# Altium schematic sheet ArduinoNanoShield.SchDoc
size A4
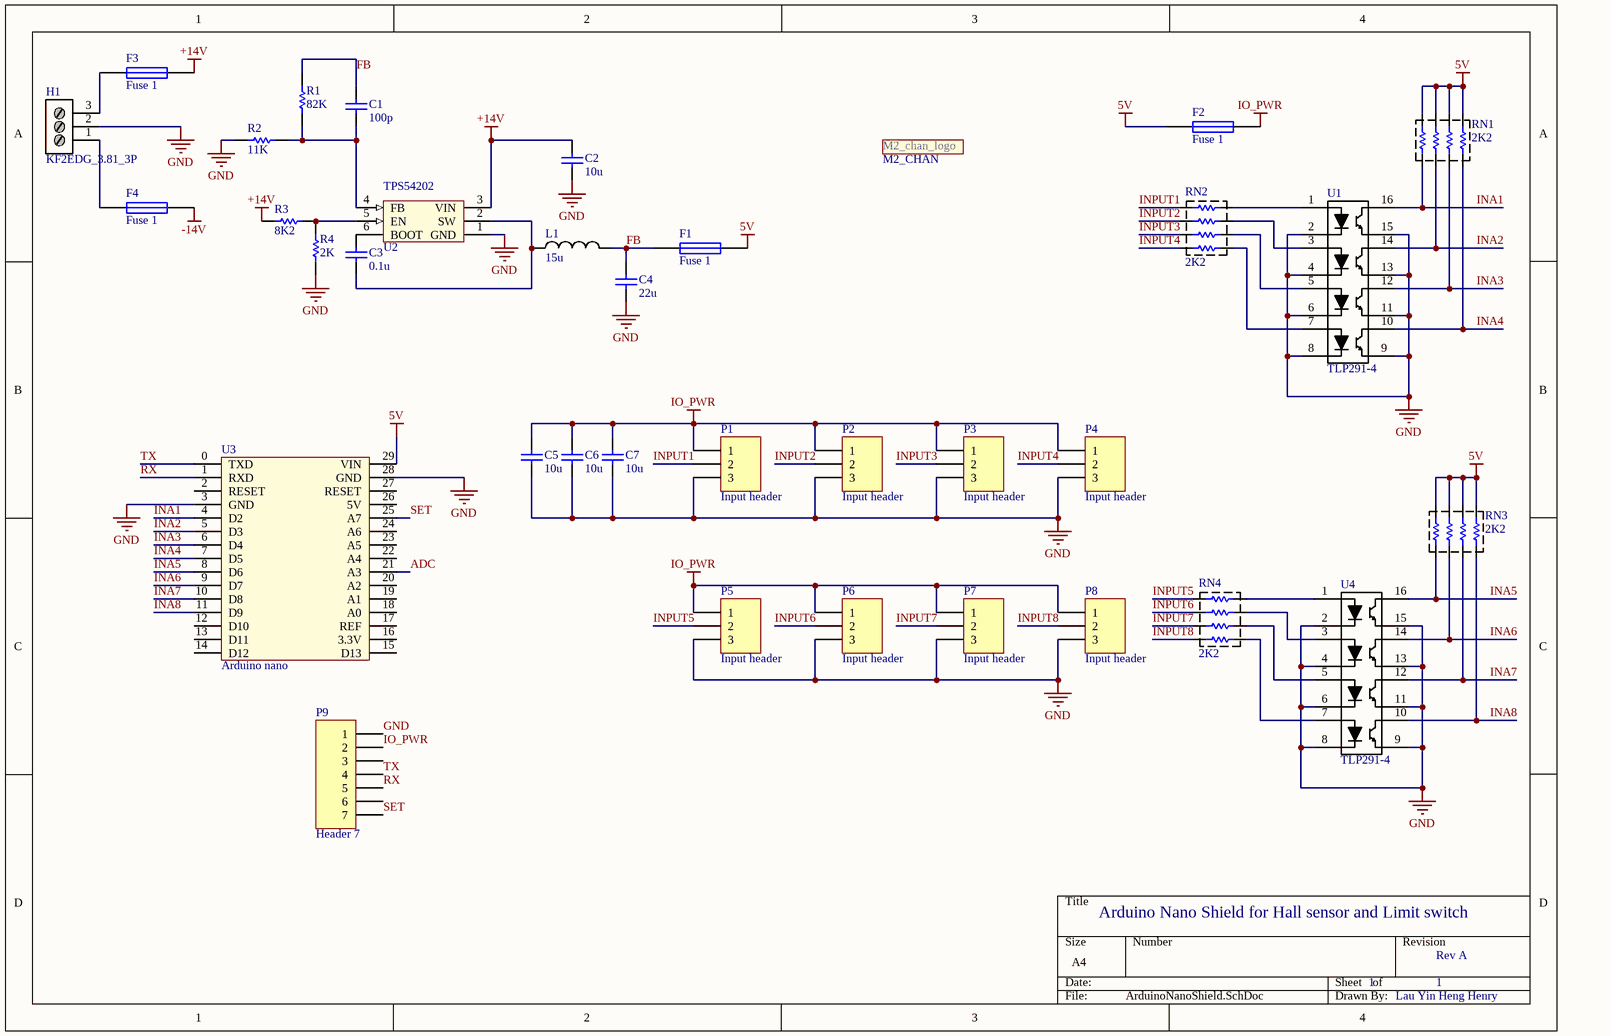
[diagram p0: ArduinoNanoShield.SchDoc]

## Parts
C1  value 100p  [CAPC1608X90N]  (hidden comment: Cap)
C2  value 10u  [CAPC2012X135N]  (hidden comment: Cap)
C3  value 0.1u  [CAPC1608X90N]  (hidden comment: Cap)
C4  value 22u  [CAPC2012X135N]  (hidden comment: Cap)
C5  value 10u  [CAPC2012X135N]  (hidden comment: Cap)
C6  value 10u  [CAPC2012X135N]  (hidden comment: Cap)
C7  value 10u  [CAPC2012X135N]  (hidden comment: Cap)
F1  Fuse 1  [FUSE_1808]
F2  Fuse 1  [FUSE_1808]
F3  Fuse 1  [FUSE_1808]
F4  Fuse 1  [FUSE_1808]
H1  KF2EDG_3.81_3P  [KF2EDG_3.81_RA_3P]
L1  value 15u  [INDC_5.5x5.3x3]  (hidden comment: 15uH inductor)
M2_CHAN  M2_CHAN  [M2_chan_thin]  (value not drawn)
P1  Input header  [HDR1X3]
P2  Input header  [HDR1X3]
P3  Input header  [HDR1X3]
P4  Input header  [HDR1X3]
P5  Input header  [HDR1X3]
P6  Input header  [HDR1X3]
P7  Input header  [HDR1X3]
P8  Input header  [HDR1X3]
P9  Header 7  [HDR1X7]
R1  value 82K  [RESC1608X55N]  (hidden comment: Res1)
R2  value 11K  [RESC1608X55N]  (hidden comment: Res1)
R3  value 8K2  [RESC1608X55N]  (hidden comment: Res1)
R4  value 2K  [RESC1608X55N]  (hidden comment: Res1)
RN1  value 2K2  [RESCAXS50P160X320X70-8N]  (hidden comment: resistor network)
RN2  value 2K2  [RESCAXS50P160X320X70-8N]  (hidden comment: resistor network)
RN3  value 2K2  [RESCAXS50P160X320X70-8N]  (hidden comment: resistor network)
RN4  value 2K2  [RESCAXS50P160X320X70-8N]  (hidden comment: resistor network)
U1  TLP291-4  [SO16]
U2  TPS54202  [SOT23-6]
U3  Arduino nano  [Arduino_Nano]
U4  TLP291-4  [SO16]

## Nets
5V: F1.2 F2.1 RN1.5 RN1.6 RN1.7 RN1.8 RN3.5 RN3.6 RN3.7 RN3.8 U3.29(VIN)
+14V: C2.1 F3.2 R3.1 U2.3(VIN)
-14V: F4.2
GND: C2.2 C4.1 C5.2 C6.2 C7.2 H1.2 P1.3 P2.3 P3.3 P4.3 P5.3 P6.3 P7.3 P8.3 P9.1 R2.2 R4.1 U1.2 U1.4 U1.6 U1.8 U1.9 U1.11 U1.13 U1.15 U2.1(GND) U3.3(GND) U3.28(GND) U4.2 U4.4 U4.6 U4.8 U4.9 U4.11 U4.13 U4.15
IO_PWR: C5.1 C6.1 C7.1 F2.2 P1.1 P2.1 P3.1 P4.1 P5.1 P6.1 P7.1 P8.1 P9.2
ADC: U3.21(A3)
FB: C1.2 C4.2 F1.1 L1.2 R1.2
INA1: RN1.1 U1.16 U3.4(D2)
INA2: RN1.2 U1.14 U3.5(D3)
INA3: RN1.3 U1.12 U3.6(D4)
INA4: RN1.4 U1.10 U3.7(D5)
INA5: RN3.1 U3.8(D6) U4.16
INA6: RN3.2 U3.9(D7) U4.14
INA7: RN3.3 U3.10(D8) U4.12
INA8: RN3.4 U3.11(D9) U4.10
INPUT1: P1.2 RN2.5
INPUT2: P2.2 RN2.6
INPUT3: P3.2 RN2.7
INPUT4: P4.2 RN2.8
INPUT5: P5.2 RN4.5
INPUT6: P6.2 RN4.6
INPUT7: P7.2 RN4.7
INPUT8: P8.2 RN4.8
RX: P9.5 U3.1(RXD)
SET: P9.7 U3.25(A7)
TX: P9.4 U3.0(TXD)
NetC1_1: C1.1 R1.1 R2.1 U2.4(FB)
NetC3_1: C3.1 L1.1 U2.2(SW)
NetC3_2: C3.2 U2.6(BOOT)
NetF3_1: F3.1 H1.3
NetF4_1: F4.1 H1.1
NetR3_2: R3.2 R4.2 U2.5(EN)
NetRN2_1: RN2.1 U1.7
NetRN2_2: RN2.2 U1.5
NetRN2_3: RN2.3 U1.3
NetRN2_4: RN2.4 U1.1
NetRN4_1: RN4.1 U4.7
NetRN4_2: RN4.2 U4.5
NetRN4_3: RN4.3 U4.3
NetRN4_4: RN4.4 U4.1

Not connected (* = marked no-connect by the designer): P9 3 6; U3 2(RESET) 12(D10) 13(D11) 14(D12) 15(D13) 16(3.3V) 17(REF) 18(A0) 19(A1) 20(A2) 22(A4) 23(A5) 24(A6) 26(5V) 27(RESET)

## Notes on the sheet
- Arduino Nano Shield for Hall sensor and Limit switch
- 1
- Rev A
- Lau Yin Heng Henry
- (in symbol M2_CHAN) M2_chan_logo

## Library data of the parts
C1-C7 = Cap: Capacitor; Published: 8-Jun-2000; LatestRevisionDate: 17-Jul-2002; LatestRevisionNote: Re-released for DXP Platform.; PackageReference: RAD-0.3; Publisher: Altium Limited; PackageDescription: Radial Cap, Thru-Hole; 2 Leads; 0.3 in Pin Spacing
F1 F3 F4 = Fuse 1: Fuse; Published: 8-Jun-2000; LatestRevisionDate: 17-Jul-2002; LatestRevisionNote: Re-released for DXP Platform.; PackageReference: PIN-W2/E2.8; Publisher: Altium Limited; PackageDescription: Thru-Hole; 2 Leads
F2 = Fuse 1: Fuse; Value: 1A; Published: 8-Jun-2000; LatestRevisionDate: 17-Jul-2002; LatestRevisionNote: Re-released for DXP Platform.; PackageReference: PIN-W2/E2.8; Publisher: Altium Limited; PackageDescription: Thru-Hole; 2 Leads
H1 = KF2EDG_3.81_3P: KF2EDG_3.81_3P screw terminal connect, must be mount at the edge of the PCB; ComponentLink1Description: taobao; ComponentLink1URL: https://detail.tmall.com/item.htm?spm=a1z10.5-b.w4011-22304010834.196.65e57086SqLu38&id=520842321119&rn=ac0e41234ca0e3d4dbc59e112a9611af&abbucket=18&skuId=3103936693268; ComponentLink2Description: taobao_w; ComponentLink2URL: https://detail.tmall.com/item.htm?spm=a1z10.5-b.w4011-22304010834.146.241269d7ykRnYE&id=597781773200&rn=4d925850b338a5756f4419dac97d6ea2&abbucket=18&skuId=4164186937753
L1 = INDC_MPX1D0530L150: 15uH inductor with 2A saturation current. Dimension is 5.5 * 5.2 * 3 mm^3; Saturation Current: 2A; ComponentLink1Description: mouser; ComponentLink1URL: https://www.mouser.hk/ProductDetail/KEMET/MPX1D0530L150?qs=%2Fha2pyFaduih4sbqyQPtG7LZJckVjGeIYe72J6FDfc6F0AQwFjgO%2FA%3D%3D
P1-P8 = Header 3: Header, 3-Pin; LatestRevisionDate: 17-Jul-2002; LatestRevisionNote: Re-released for DXP Platform.; Publisher: Altium Limited
P9 = Header 7: Header, 7-Pin; LatestRevisionDate: 17-Jul-2002; LatestRevisionNote: Re-released for DXP Platform.; Publisher: Altium Limited
R1-R4 = Res1: Resistor; Published: 8-Jun-2000; LatestRevisionDate: 17-Jul-2002; LatestRevisionNote: Re-released for DXP Platform.; PackageReference: AXIAL-0.3; Publisher: Altium Limited; PackageDescription: Axial Device, Thru-Hole; 2 Leads; 0.3 in Pin Spacing
RN1-RN4 = RES_NET
U2 = TPS54202: 4.5-28V input 2A output step down, EMI Friendly Synchronous Step Down Converter; Vin(max): 28V; Vin(min): 4.5V; Currrent: 2A
U3 = ArduinoNano: Arduino nano shield pin out
U1 U4 = TLP291-4: Link: https://www.mouser.hk/ProductDetail/Toshiba/TLP291-4GB-TPE?qs=sGAEpiMZZMteimceiIVCB3qZhEwbmgeEa%252BDKcYuRaWM=; Parameter 1: *